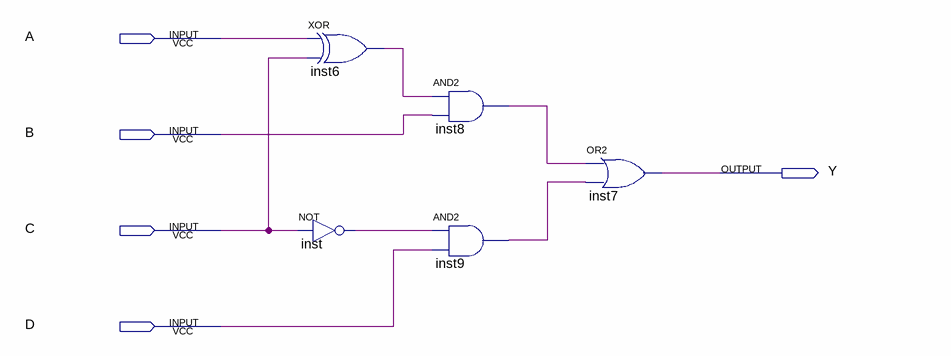
[diagram p0: schematic sheet]
// Quartus schematic LAB1_1.bdf as structural Verilog: 5 symbols, 5 pins
module LAB1_1 (
  input  A,
  input  B,
  input  C,
  input  D,
  output Y
);

  wire inst6_out, inst8_out, inst9_out, inst_out;

  xor inst6 (inst6_out, A, C);
  not inst (inst_out, C);
  and inst8 (inst8_out, inst6_out, B);
  and inst9 (inst9_out, inst_out, D);
  or inst7 (Y, inst8_out, inst9_out);
endmodule
